# Altium schematic sheet GSM Signal Block Diagram.SchDoc: Signal Control Block Diagram
size 292 x 193 mm; SheetNumber: 25; SheetTotal: 40
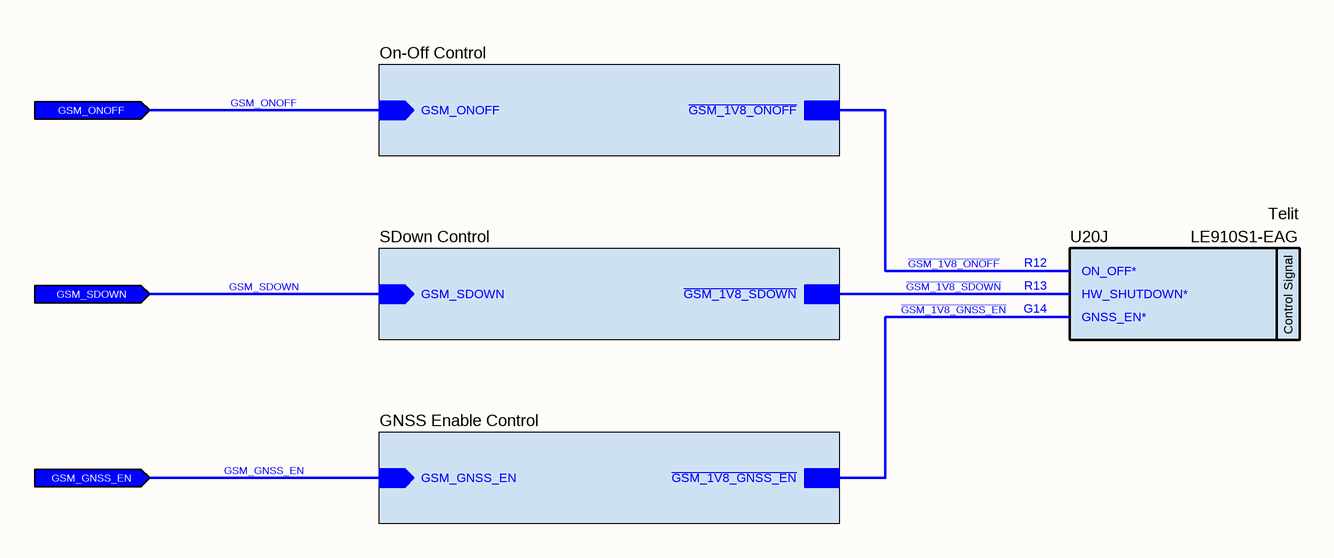
[diagram p0: GSM Signal Block Diagram.SchDoc]

## Parts
U20  Manufacturer Part Number: LE910S1-EAG  Manufacturer Name: Telit  [LE910 GSM Modem]  (hidden comment: LE910S1-EAG LTE GSM Module)  (part J of 19)

## Sub-sheets
GNSS Enable Control = GSM GNSS En Signal Control.SchDoc: GSM_GNSS_EN (in), ~{GSM_1V8_GNSS_EN}
On-Off Control = GSM On-Off Signal Control.SchDoc: GSM_ONOFF (in), ~{GSM_1V8_ONOFF}
SDown Control = GSM Shut Down Signal Control.SchDoc: GSM_SDOWN (in), ~{GSM_1V8_SDOWN}

## Ports
GSM_GNSS_EN (in), GSM_ONOFF (in), GSM_SDOWN (in)

## Nets
~{GSM_1V8_GNSS_EN}: U20.G14(GNSS_EN*) ; sheet GNSS Enable Control/~{GSM_1V8_GNSS_EN}
~{GSM_1V8_ONOFF}: U20.R12(ON_OFF*) ; sheet On-Off Control/~{GSM_1V8_ONOFF}
~{GSM_1V8_SDOWN}: U20.R13(HW_SHUTDOWN*) ; sheet SDown Control/~{GSM_1V8_SDOWN}
GSM_GNSS_EN: port GSM_GNSS_EN, sheet GNSS Enable Control/GSM_GNSS_EN
GSM_ONOFF: port GSM_ONOFF, sheet On-Off Control/GSM_ONOFF
GSM_SDOWN: port GSM_SDOWN, sheet SDown Control/GSM_SDOWN

## Notes on the sheet
- © 2022 All rights reserved.
  This document may not, in whole or in part, be copied, photocopied, reproduced, translated or converted to any electronic or machine readable from without prior written permission of Mehmet Günce Akkoyun.
  Engineer contact : akkoyun@me.com
- Property of
- Engineer :
- Date :
- Size :
- A4
- Time :
- Project :
- Page :
- /
- Customer :
- Product ID :
- Module ID :
- Version :
- File :
- Revision :
- (in symbol IC - LE910S1-EAG, part J) Control Signal

## Library data of the parts
U20 = IC - LE910S1-EAG: Telit LE910S1-EAG GPRS/GNSS Module; Case: BGA